# Altium project Motor Control.PrjPcb
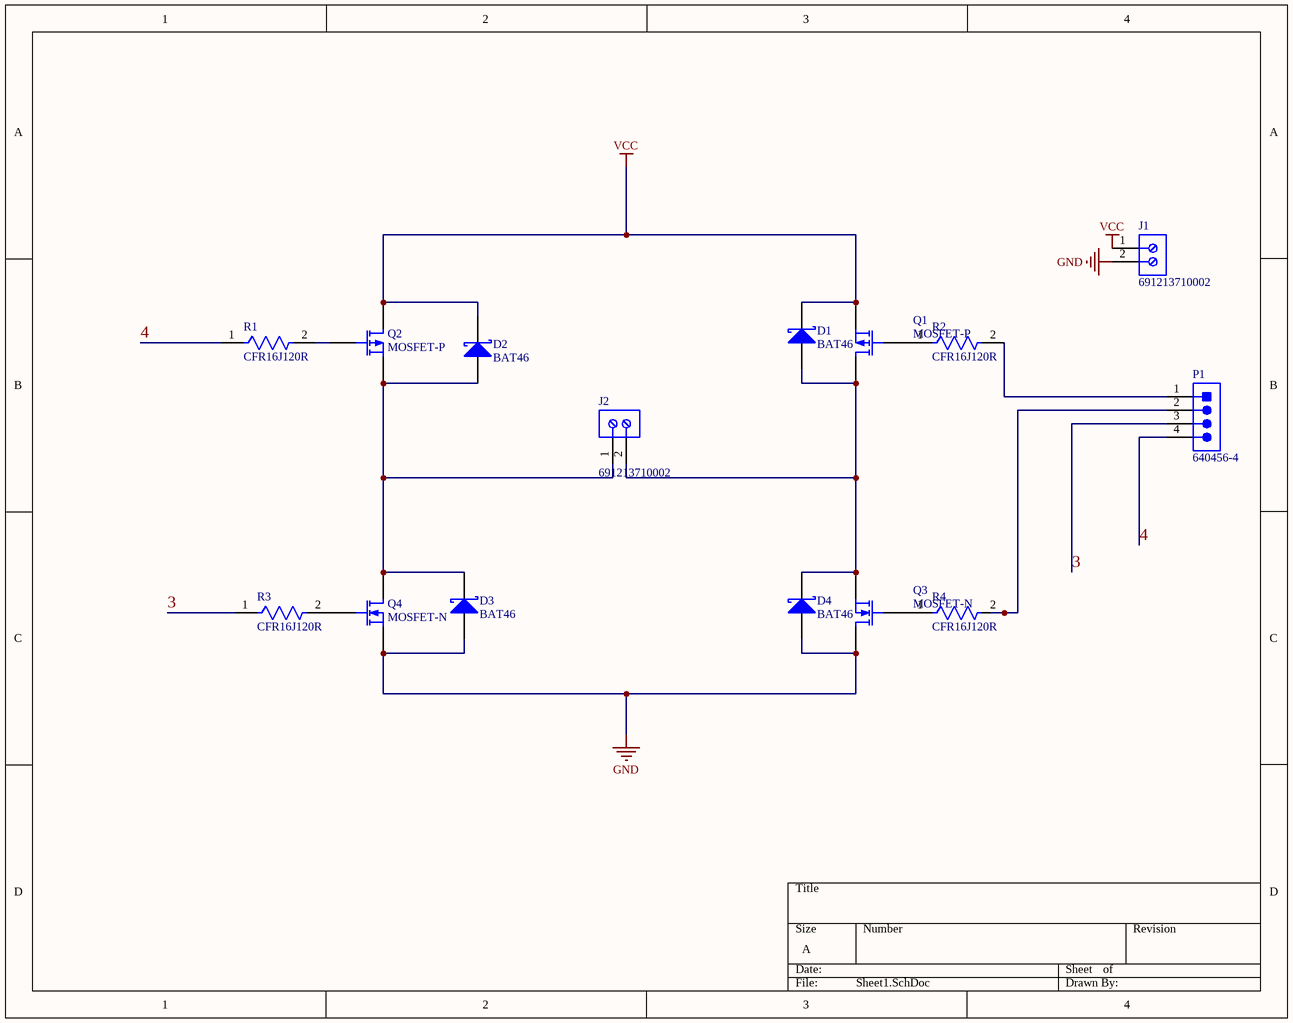
[diagram p0: Sheet1.SchDoc]
1 sheet, 15 parts. Net scope: global (net labels, ports and power ports of the same name join across sheets).
Board file: PCB1.PcbDoc

## Sheet Sheet1.SchDoc
size A; SheetNumber: 1; SheetTotal: 1; SPICEModelCacheLXVKQESM: <root> / <DocumentId>LXVKQESM</DocumentId> / <CacheFrame Number="0"> / <Model Name="pmos" Kind="MDL"> / <Text>*Default P-Channel MOSFET / *Pinout: D,G,S / .MODEL PMOS PMOS()</Text> / </Model> / <Model Name="nmos" Kind="MDL"> / <Text>*Default N-Channel MOSFET / *Pinout: D,G,S / .MODEL NMOS NMOS()</Text> / </Model> / </CacheFrame> / </root>

### Parts
D1  BAT46  [STM-DO-35-2]
D2  BAT46  [STM-DO-35-2]
D3  BAT46  [STM-DO-35-2]
D4  BAT46  [STM-DO-35-2]
J1  691213710002  [691213710002]
J2  691213710002  [691213710002]
P1  640456-4  [TECO-640456-4]
Q1  MOSFET-P  [E3]
Q2  MOSFET-P  [E3]
Q3  MOSFET-N  [E3]
Q4  MOSFET-N  [E3]
R1  CFR16J120R  [FP-CFR16-MFG]
R2  CFR16J120R  [FP-CFR16-MFG]
R3  CFR16J120R  [FP-CFR16-MFG]
R4  CFR16J120R  [FP-CFR16-MFG]

### Nets
GND: D3.1(A) D4.1(A) J1.2 Q3.1(D) Q4.3(S)
VCC: D1.2(K) D2.2(K) J1.1 Q1.3(S) Q2.1(D)
3: P1.3 R3.1
4: P1.4 R1.1
NetD1_1: D1.1(A) D4.2(K) J2.2 Q1.1(D) Q3.3(S)
NetD2_1: D2.1(A) D3.2(K) J2.1 Q2.3(S) Q4.1(D)
NetP1_1: P1.1 R2.2
NetP1_2: P1.2 R4.2
NetQ1_2: Q1.2(G) R2.1
NetQ2_2: Q2.2(G) R1.2
NetQ3_2: Q3.2(G) R4.1
NetQ4_2: Q4.2(G) R3.2

### Library data of the parts
D1-D4 = CMP-2000-05926-1: Small Signal Schottky Diode, 150 mA, 100 V, -65 to 125 degC, 2-Pin DO-35, RoHS, Tape and Reel; Manufacturer: STMicroelectronics; SVHC: NoSVHC(15-Jun-2015); Diode Configuration: Single; No. of Pins: 2Pins; Forward Surge Current Ifsm Max: 750mA; Repetitive Reverse Voltage Vrrm Max: 100V; Diode Case Style: DO-204AH; Forward Voltage VF Max: 1V; Forward Current If(AV): 150mA; Manufacturer URL: http://www.st.com/; Packaging: Tape&Reel; Package Reference: DO-35-2; Datasheet URL: http://www.st.com/content/ccc/resource/technical/document/datasheet/group1/11/76/e4/a3/df/07/49/14/CD00000767/files/CD00000767.pdf/jcr:content/translations/en.CD00000767.pdf; Diode Type: Schottky; Mounting Technology: ThroughHole; Package Description: 2-Pin Axial Lead, Dia 1.765 mm, Body Length 3.775 mm; Product Range: -; Datasheet Version: Rev. 2.1, 10/2001; Operating Temperature Max: 125°C
J1 J2 = CMP-1502-02526-2: NexarPartId: 8917718; Number of Contacts: 2; Current Rating: 10A; Stripping Length: -7mm; Wire Gauge (Max): 26AWG; Plating: Brass, Steel; Wire Gauge (Min): 16AWG; Voltage: 300V; Number of Levels: 1; Pitch: 5.0038mm; Color: Green; Number of Pins: 2; Housing Material: Nylon; Termination: Screw; Max Operating Temperature: 105°C; Min Operating Temperature: -40°C; Packaging: Box; Current: 10A; REACH SVHC: Unknown; Width: 10.6mm; RoHS: Compliant; Mount: Through Hole; Height: 10mm; Contact Material: Brass; Length: 8.3mm; Lead Pitch: 5mm; Wire/Cable Gauge: 26AWG; Voltage Rating: 300V; Number of Positions Per Level: 2; Contact Plating: Tin
P1 = CMP-2000-05419-1: Male Header, Pitch 2.54 mm, 1 x 4 Position, Height 10.03 mm, Tail Length 3.56 mm, RoHS, Bulk; Manufacturer: TE Connectivity; Material, Housing: Polyester; Primary Type: InterconnectSystem; Mount Angle: Vertical; Color, Housing: White; Current, Rating: 5 / A; Agency Approvals: CSA,UL; Contact Termination Area Plating: Tin; Temperature, Operating: -55to+105 / degC; Standards: RoHSCompliant,ELVCompliant,UL94V-0; Number of Positions: 4; Brand/Series: MTA-100Series; Angle: Straight; Pin Spacing: 0.1 / "; Material, Contact: CopperAlloy; Connector Type: MTA-100; Special Features: Pinstrip; Mounting Hole Size: 0.04 / "; Contact Centerline Spacing: 0.100 / in.; Voltage, Rating: 250 / V; Manufacturer URL: http://www.te.com/; Length, Pin: 0.14 / "; Length, Overall: 0.4 / "; Color: White; Flammability Rating: UL94V-0; Mounting Type: PCMount; Termination: Solder; Datasheet URL: https://datasheet.ciiva.com/16286/eng-ds-82056-mta-0608-16286228.pdf; Number of Contacts: 4; Contact Shape: Square; Contact Mating Area Plating: Tin; Length, Terminal Post: 0.14 / in.; Size, Post: 0.025 / in.; Contact Plating: Tin; Type: PCBPlug; Datasheet Version: Dec-14; Number of Rows: 1
Q1 Q2 = MOSFET-P: P-Channel MOSFET; Published: 8-Jun-2000; LatestRevisionDate: 17-Jul-2002; LatestRevisionNote: Re-released for DXP Platform.; PackageVersion: 1995/1996; PackageReference: E3; Publisher: Altium Limited; PackageDescription: TO, Flat Index; 3 In-Line, Axial Leads; Body Dia. 4.6mm; Lead Dia. 0.5 mm (max)
Q3 Q4 = MOSFET-N: N-Channel MOSFET; Published: 8-Jun-2000; LatestRevisionDate: 17-Jul-2002; LatestRevisionNote: Re-released for DXP Platform.; PackageVersion: 1995/1996; PackageReference: E3; Publisher: Altium Limited; PackageDescription: TO, Flat Index; 3 In-Line, Axial Leads; Body Dia. 4.6mm; Lead Dia. 0.5 mm (max)
R1-R4 = CMP-03212-000007-1: RES 120 OHM 1/4W 5% AXIAL; Resistance: 120R; Power Rating: 250mW; Number of Resistors: 1; Voltage Rating: 200V; Temperature Coefficient: 0ppm/°C; RoHS Compliant: Yes; Mount: Axial; Package Quantity: 5000; Diameter: 1.85mm; Number of Terminations: 2; Packaging: Cut Tape; Max Operating Temperature: 155°C; Resistance Tolerance: 5%; Termination: Axial; Length: 3.5mm; Max Power Dissipation: 250mW; Min Operating Temperature: -55°C; Resistor Type: Thin Film; Technology: CARBON FILM; Case/Package: Axial; Tolerance: 5%; Series: CFR16, Neohm; Voltage Rating (DC): 200V; ELV: Compliant; REACH SVHC: No SVHC